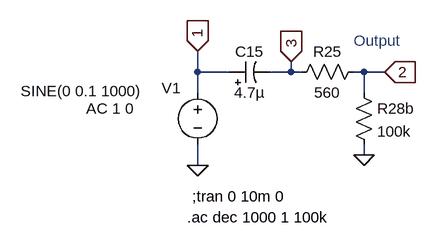
[diagram p0: schematic Klon-Centaur_output_v1.asc]
Klon-Centaur_output_v1.asc, the LTspice schematic file:
Version 4
SHEET 1 4496 5064
WIRE 480 2368 480 2336
WIRE 528 2368 480 2368
WIRE 624 2368 624 2352
WIRE 624 2368 592 2368
WIRE 640 2368 624 2368
WIRE 736 2368 720 2368
WIRE 768 2368 736 2368
WIRE 480 2400 480 2368
WIRE 736 2400 736 2368
WIRE 736 2496 736 2480
WIRE 480 2512 480 2480
FLAG 480 2336 1
IOPIN 480 2336 In
FLAG 768 2368 2
IOPIN 768 2368 In
FLAG 480 2512 0
FLAG 736 2496 0
FLAG 624 2352 3
IOPIN 624 2352 In
SYMBOL voltage 480 2384 R0
WINDOW 0 -55 9 Left 2
WINDOW 123 -171 40 Left 2
WINDOW 39 0 0 Left 0
WINDOW 3 -272 13 Left 2
SYMATTR InstName V1
SYMATTR Value2 AC 1 0
SYMATTR Value SINE(0 0.1 1000)
SYMBOL res 736 2352 R90
WINDOW 0 0 56 VBottom 2
WINDOW 3 32 56 VTop 2
SYMATTR InstName R25
SYMATTR Value 560
SYMBOL res 720 2384 R0
SYMATTR InstName R28b
SYMATTR Value 100k
SYMBOL polcap 528 2384 R270
WINDOW 0 32 32 VTop 2
WINDOW 3 0 32 VBottom 2
SYMATTR InstName C15
SYMATTR Value 4.7µ
TEXT 464 2592 Left 2 !.ac dec 1000 1 100k
TEXT 720 2320 Left 2 ;Output
TEXT 472 2560 Left 2 !;tran 0 10m 0

The netlist it stands for:
* Klon-Centaur_output_v1.asc
V1 1 0 SINE(0 0.1 1000) AC 1 0
R25 2 3 560
R28b 2 0 100k
C15 1 3 4.7µ
.ac dec 1000 1 100k
* Output
;tran 0 10m 0
.backanno
.end